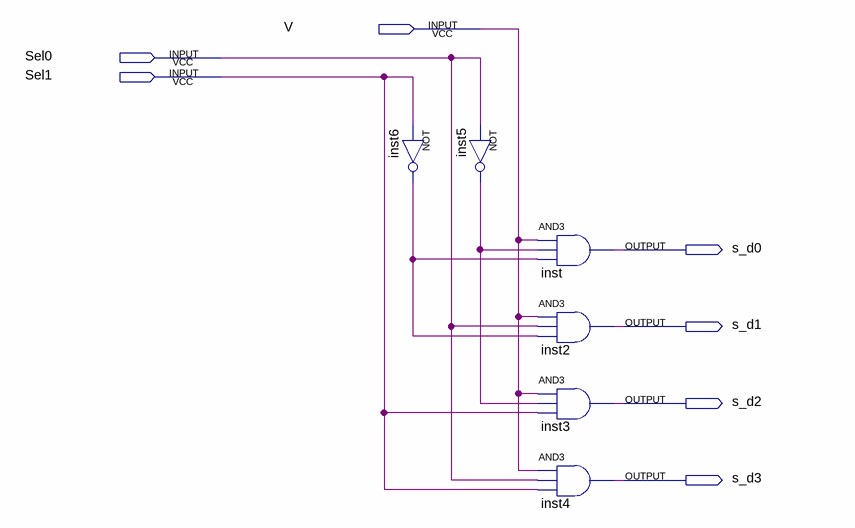
[diagram p0: schematic sheet]
// Quartus schematic dmux1x4.bdf as structural Verilog: 6 symbols, 7 pins
module dmux1x4 (
  input  V,
  input  Sel0,
  input  Sel1,
  output s_d0,
  output s_d1,
  output s_d2,
  output s_d3
);

  wire inst5_out, inst6_out;

  not inst5 (inst5_out, Sel0);
  not inst6 (inst6_out, Sel1);
  and inst (s_d0, V, inst5_out, inst6_out);
  and inst2 (s_d1, V, Sel0, inst6_out);
  and inst3 (s_d2, V, inst5_out, Sel1);
  and inst4 (s_d3, V, Sel0, Sel1);
endmodule
